# Altium project FlexV1.PrjPcb (part 2 of 3)

## Sheet PowerMM.SchDoc
size A4; Organization: TU Darmstadt; Address1: IES; Address2: Merckstraße 25; Address3: 64283 Darmstadt; Address4: Germany; SheetNumber: 3; SheetTotal: 4
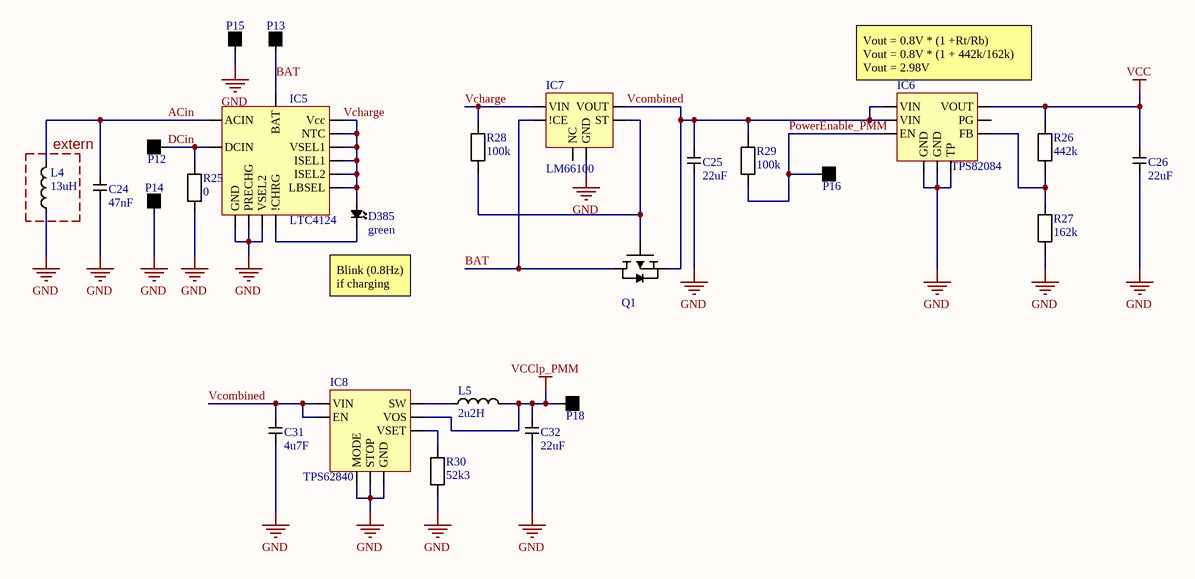
[diagram p2: PowerMM.SchDoc]

### Parts
C24  47nF  [RC0603]
C25  22uF  [C0805]
C26  22uF  [C0805]
C31  4u7F  [C0805]
C32  22uF  [C0805]
D385  green  [LTST-C190EKT]
IC5  LTC4124  [LTC4124]
IC6  TPS82084  [TPS82084]
IC7  LM66100  [LM66100]
IC8  TPS62840  [TPS62840DLC]
L4  13uH  [ChargeInductorPads]
L5  2u2H  [C0805]
P12  Solderpad  [SolderPad]  (value not drawn)  (no BOM)
P13  Solderpad  [SolderPad]  (value not drawn)  (no BOM)
P14  Solderpad  [SolderPad]  (value not drawn)  (no BOM)
P15  Solderpad  [SolderPad]  (value not drawn)  (no BOM)
P16  Solderpad  [SolderPad]  (value not drawn)  (no BOM)
P18  Solderpad  [SolderPad]  (value not drawn)  (no BOM)
Q1  NTR4101PT1G  [NTR4101P]  (value not drawn)
R25  0  [RC0402]
R26  442k  [RC0603]
R27  162k  [RC0603]
R28  100k  [RC0603]
R29  100k  [RC0603]
R30  52k3  [RC0603]

### Blocks framed on the sheet
extern: L4

### Nets
GND: C24.1 C25.1 C26.1 C31.1 C32.1 IC5.3(PRECHG) IC5.5(VSEL2) IC5.13(GND) IC6.5(GND) IC6.6(GND) IC6.9(TP) IC7.2(GND) IC8.1(GND) IC8.3(MODE) IC8.6(STOP) L4.1(X) P14.1 P15.1 R25.1 R27.1 R30.1
VCC: C26.2 IC6.8(VOUT) R26.2
VCClp_PMM: C32.2 IC8.8(VOS) L5.2(X) P18.1
ACin: C24.2 IC5.11(ACIN) L4.2(X)
BAT: IC5.10(BAT) IC7.3(!CE) P13.1 Q1.3
DCin: IC5.12(DCIN) P12.1 R25.2
PowerEnable_PMM: IC6.1(EN) P16.1 R29.1
Vcharge: D385.A IC5.1(Vcc) IC5.4(VSEL1) IC5.6(ISEL1) IC5.7(ISEL2) IC5.8(LBSEL) IC5.9(NTC) IC7.1(VIN) R28.2
Vcombined: C25.2 C31.2 IC6.3(VIN) IC6.4(VIN) IC7.6(VOUT) IC8.2(VIN) IC8.4(EN) Q1.2 R29.2
NetD385_K: D385.K IC5.2(!CHRG)
NetIC6_7: IC6.7(FB) R26.1 R27.2
NetIC7_5: IC7.5(ST) Q1.1 R28.1
NetIC8_5: IC8.5(VSET) R30.2
NetIC8_7: IC8.7(SW) L5.1(X)

Not connected (* = marked no-connect by the designer): IC6 2(PG); IC7 4(NC)

### Notes on the sheet
- (near IC6) Vout = 0.8V * (1 +Rt/Rb)
  Vout = 0.8V * (1 + 442k/162k)
  Vout = 2.98V
- DCIN:5.5-3.3V
- Backup resistor
  I
- Blink (0.8Hz) if charging
- Value from table page 13
- Title:
- File:
- Project:
- Variant:
- Date:
- Revision:
- Author:
- Sheet:
- of

### Library data of the parts
C24 = CL10B473KB8NNNC: CAP CER 0.047UF 50V X7R 0603; Manufacturer: Samsung; Material: Ceramic; Dielectric: Y5V; Tolerance: 10%; Supplier 1: Digi-Key; Manufacturer Part Number: CL10B473KB8NNNC; RoHS: Yes; Category: Ceramic Capacitors; Stock 1: 49161; Pricing 1: 1=0,10000, 10=0,04200, 100=0,01860, 500=0,01328, 1000=0,01044 (USD); Mount: Surface Mount; Case/Package: 0603; Contact Plating: Tin; Case Code (Imperial): 0603; Case Code (Metric): 1608; Min Operating Temperature: -55°C; Max Operating Temperature: 125°C; Packaging: Tape and Reel; Package Quantity: 4000; Voltage Rating (DC): 50V; Capacitance: 47nF; Voltage Rating: 50V; Voltage: 50V; Length: 1.6mm; Height: 0.8mm; Thickness: 0.035inch; Depth: 0.8mm; Width: 0.031inch; Radiation Hardening: No; Lead Free: Lead Free; ComponentLink1URL: https://datasheet.ciiva.com/25802/cl10b473kb8nnnc-25802915.pdf?src-supplier=Digi-Key; ComponentLink1Description: https://datasheet.ciiva.com/25802/cl10b473kb8nnnc-25802915.pdf?src-supplier=Digi-Key; ComponentLink2URL: https://datasheet.ciiva.com/15216/getdatasheetpartid-359560-15216232.pdf?src-supplier=Verical; ComponentLink2Description: https://datasheet.ciiva.com/15216/getdatasheetpartid-359560-15216232.pdf?src-supplier=Verical; ComponentLink3URL: https://datasheet.ciiva.com/29198/456947-da-01-en-vs-kondensator-0603-29198896.pdf?src-supplier=Conrad; ComponentLink3Description: https://datasheet.ciiva.com/29198/456947-da-01-en-vs-kondensator-0603-29198896.pdf?src-supplier=Conrad; ComponentLink4URL: https://datasheet.ciiva.com/26310/mlcc-catalogdownload2013-eng-26310327.pdf?src-supplier=Distrelec; ComponentLink4Description: https://datasheet.ciiva.com/26310/mlcc-catalogdownload2013-eng-26310327.pdf?src-supplier=Distrelec; ComponentLink5URL: https://datasheet.ciiva.com/20173/71-0317-20173339.pdf?src-supplier=Rapid+Electronics; ComponentLink5Description: https://datasheet.ciiva.com/20173/71-0317-20173339.pdf?src-supplier=Rapid+Electronics; Supplier Part Number 1: 1276-1063-1-ND
C25 C26 C32 = C2012X7S1A226M125AC: TDK - C2012X7S1A226M125AC - SMD Multilayer Ceramic Capacitor, 22 µF, 10 V, 0805 [2012 Metric], ± 20%, X7S, C Series TDK; Voltage Rating (DC): 10V; Supplier 1: Digi-Key; Manufacturer: TDK; Manufacturer Part Number: C2012X7S1A226M125AC; RoHS: Yes; Category: Ceramic Capacitors; Stock 1: 665121; Pricing 1: 1=0,97000, 10=0,74000, 100=0,52940, 500=0,40986, 1000=0,35294 (USD); Mount: Surface Mount; Case/Package: 0805; Weight: 0.000194oz; Case Code (Imperial): 0805; Dielectric Material: Ceramic; Case Code (Metric): 2012; Min Operating Temperature: -55°C; Max Operating Temperature: 125°C; Termination: SMD/SMT; Package Quantity: 2000; Packaging: Tape and Reel; Capacitance: 22uF; Tolerance: 20%; Voltage Rating: 10V; Dielectric: X7S; Length: 0.079inch; Height: 1.25mm; Width: 1.25mm; Thickness: 0.057inch; Lead Free: Lead Free; REACH SVHC: No SVHC; ComponentLink1URL: https://datasheet.ciiva.com/14893/tdkmlcccaprange-14893287.pdf?src-supplier=Digi-Key; ComponentLink1Description: https://datasheet.ciiva.com/14893/tdkmlcccaprange-14893287.pdf?src-supplier=Digi-Key; ComponentLink2URL: https://datasheet.ciiva.com/14893/tdkmlcccaprange-14893288.pdf?src-supplier=Digi-Key; ComponentLink2Description: https://datasheet.ciiva.com/14893/tdkmlcccaprange-14893288.pdf?src-supplier=Digi-Key; ComponentLink3URL: https://datasheet.ciiva.com/14893/tdkmlcccaprange-14893289.pdf?src-supplier=Digi-Key; ComponentLink3Description: https://datasheet.ciiva.com/14893/tdkmlcccaprange-14893289.pdf?src-supplier=Digi-Key; Supplier Part Number 1: 445-14560-1-ND
C31 = CL21A475KAQNNNE: SAMSUNG ELECTRO-MECHANICS - CL21A475KAQNNNE - SMD Multilayer Ceramic Capacitor, 4.7 µF, 25 V, 0805 [2012 Metric], ± 10%, X5R, CL Series; Voltage Rating (DC): 25V; Capacitance: 4.7uF; Supplier 1: Digi-Key; Manufacturer: Samsung; Manufacturer Part Number: CL21A475KAQNNNE; RoHS: Yes; Category: Ceramic Capacitors; Stock 1: 481244; Pricing 1: 1=0,14000, 10=0,10000, 100=0,04680, 500=0,03282, 1000=0,02716 (USD); Mount: Surface Mount; Case/Package: 0805; Case Code (Metric): 2012; Case Code (Imperial): 0805; Min Operating Temperature: -55°C; Max Operating Temperature: 85°C; Dielectric: X5R; Package Quantity: 1; Packaging: Tape and Reel; Tolerance: 10%; Voltage Rating: 25V; Length: 2mm; Height: 1.25mm; Thickness: 0.055inch; Depth: 1.25mm; Width: 0.049inch; Radiation Hardening: No; Lead Free: Lead Free; ComponentLink1URL: https://datasheet.ciiva.com/25798/cl21a475kaqnnne-25798882.pdf?src-supplier=Digi-Key; ComponentLink1Description: https://datasheet.ciiva.com/25798/cl21a475kaqnnne-25798882.pdf?src-supplier=Digi-Key; Supplier Part Number 1: 1276-1244-1-ND
D385 = LTST-C190GKT: LED,  LTST-C190GKT; Manufacturer: Vishay Lite-On; Lens Color: Colorless; Luminous Intensity: 6mcd; Forward Voltage: 2.1V; Viewing Angle: 130°; Lens Style: Clear,Diffused,Colorless,Rectangular; Forward Current: 30mA; Power Rating: 100mW; Dominant Wavelength: 569nm; Test Current: 10mA; Lens Transparency: Clear; Number of Elements: 1; Reverse Voltage: 5V; Wavelength: 565nm; Voltage: 2V; Supplier 1: Digi-Key; Manufacturer Part Number: LTST-C190GKT; RoHS: Yes; Category: LEDs; Stock 1: 179506; Pricing 1: 1=0,24000, 10=0,17900, 100=0,08460, 500=0,05640, 1000=0,04418 (USD); Mount: Surface Mount; Case/Package: 0603; Number of Pins: 2; Color: Green; Case Code (Metric): 1608; Case Code (Imperial): 0603; Min Operating Temperature: -55°C; Max Operating Temperature: 85°C; Package Quantity: 1; Packaging: Tape and Reel; Illumination Color: Green; Power Dissipation: 100mW; Number of LEDs: 1; Length: 1.6mm; Height: 0.8mm; Width: 0.8mm; Depth: 0.8mm; Radiation Hardening: No; Lead Free: Lead Free; ComponentLink1URL: https://datasheet.ciiva.com/11775/0900766b80dc02a6-11775616.pdf?src-supplier=RSComponents; ComponentLink1Description: https://datasheet.ciiva.com/11775/0900766b80dc02a6-11775616.pdf?src-supplier=RSComponents; ComponentLink2URL: https://datasheet.ciiva.com/16392/lite-on20ltst-c190gkt-16392818.pdf?src-supplier=Future+Electronics; ComponentLink2Description: https://datasheet.ciiva.com/16392/lite-on20ltst-c190gkt-16392818.pdf?src-supplier=Future+Electronics; ComponentLink3URL: https://datasheet.ciiva.com/12403/lite-on-ltst-c190gkt-187204-12403884.pdf?src-supplier=Mouser; ComponentLink3Description: https://datasheet.ciiva.com/12403/lite-on-ltst-c190gkt-187204-12403884.pdf?src-supplier=Mouser; ComponentLink4URL: https://datasheet.ciiva.com/2109/ltst-c190gkt-2109985.pdf?src-supplier=Digi-Key; ComponentLink4Description: https://datasheet.ciiva.com/2109/ltst-c190gkt-2109985.pdf?src-supplier=Digi-Key; ComponentLink5URL: https://datasheet.ciiva.com/2109/ltst-c190gkt-2109987.pdf?src-supplier=Digi-Key; ComponentLink5Description: https://datasheet.ciiva.com/2109/ltst-c190gkt-2109987.pdf?src-supplier=Digi-Key; ComponentLink6URL: https://datasheet.ciiva.com/2109/ltst-c190gkt-2109986.pdf?src-supplier=Digi-Key; ComponentLink6Description: https://datasheet.ciiva.com/2109/ltst-c190gkt-2109986.pdf?src-supplier=Digi-Key; Supplier Part Number 1: 160-1183-1-ND
IC5 = LTC4124EV#TRMPBF: Linear Battery Charger Li-Ion 100mA 4V/4.1V/4.2V/4.35V 12-Pin LQFN EP Reel; Manufacturer: Analog Devices; Supplier 1: Digi-Key; Manufacturer Part Number: LTC4124EV#TRMPBF; RoHS: No; Category: Battery Management; Stock 1: 697; Pricing 1: 1=6,61000, 25=3,66000, 100=3,65400 (USD); Supplier Part Number 1: LTC4124EV#TRMPBFCT-ND
IC6 = TPS82084SILR: TEXAS INSTRUMENTS - TPS82084SILR - Convert. DC/DC POL, Ajust. Buck, Micro SIP, Entrée 2,5V à 6V, Sortie 0,8V à 6V/2A, 2,4MHz, µSIP-8; Number of Outputs: 1; Min Input Voltage: 2.5V; Min Output Voltage: 800mV; Output Current: 2A; Switching Frequency: 2.4MHz; Synchronous Rectifier: Yes; Efficiency: 95%; Quiescent Current: 17uA; Output Type: Adjustable; Output Configuration: Positive; Supplier 1: Digi-Key; Manufacturer: Texas Instruments; Manufacturer Part Number: TPS82084SILR; RoHS: Yes; Category: Board Mount Modules; Stock 1: 15299; Pricing 1: 1=2,78000, 10=2,49900, 25=2,36240, 100=1,89000, 250=1,78500, 500=1,68000, 1000=1,43850 (USD); Mount: Surface Mount; Case/Package: Module; Number of Pins: 8; Min Operating Temperature: -40°C; Max Operating Temperature: 125°C; Packaging: Tape and Reel; Max Input Voltage: 6V; Max Output Voltage: 6V; Output Voltage: 6V; Max Output Current: 2A; Operating Supply Voltage: 6V; Lead Free: Lead Free; ComponentLink1URL: http://www.ti.com/lit/ds/symlink/tps82084.pdf?src-supplier=Digi-Key; ComponentLink1Description: http://www.ti.com/lit/ds/symlink/tps82084.pdf?src-supplier=Digi-Key; ComponentLink2URL: http://www.ti.com/general/docs/suppproductinfo.tsp?distId=10&amp;gotoUrl=http%3A%2F%2Fwww.ti.com%2Flit%2Fgpn%2Ftps82084&src-supplier=Digi-Key; ComponentLink2Description: http://www.ti.com/general/docs/suppproductinfo.tsp?distId=10&amp;gotoUrl=http%3A%2F%2Fwww.ti.com%2Flit%2Fgpn%2Ftps82084&src-supplier=Digi-Key; ComponentLink3URL: http://www.ti.com/general/docs/lit/getliterature.tsp?genericPartNumber=TPS82084&&fileType=pdf&src-supplier=Avnet; ComponentLink3Description: http://www.ti.com/general/docs/lit/getliterature.tsp?genericPartNumber=TPS82084&&fileType=pdf&src-supplier=Avnet; Supplier Part Number 1: 296-46279-1-ND
IC7 = LM66100DCKR: 1.5-V to 5.5-V, 1.5-A, 0.5-uA IQ ideal diode with Integrated FET 6-SC70 -40 to 105; Manufacturer: Texas Instruments; Supplier 1: Digi-Key; Manufacturer Part Number: LM66100DCKR; RoHS: No; Category: Integrated Circuits (ICs); Stock 1: 5662; Pricing 1: 1=0,41000, 10=0,32900, 25=0,30120, 100=0,20300, 250=0,16800, 500=0,15400, 1000=0,11550 (USD); Supplier Part Number 1: 296-53541-1-ND
IC8 = TPS62840DLCR: 60-nA IQ, 1.8-V to 6.5-VIN, high-efficiency 750-mA step-down converter 8-VSON-HR -40 to 125; Manufacturer: Texas Instruments; Supplier 1: Digi-Key; Manufacturer Part Number: TPS62840DLCR; RoHS: No; Category: Voltage Regulators - Switching; Stock 1: 6619; Pricing 1: 1=1,83000, 10=1,64300, 25=1,55000, 100=1,24000, 250=1,08500, 500=1,05400, 1000=0,83700 (USD); Supplier Part Number 1: 296-TPS62840DLCRCT-ND
L4 = 760308101208: WURTH ELEKTRONIK - 760308101208 - WIRELESS POWER CHARGING COIL, 13UH, 10%; Manufacturer: Wurth Electronics; Logic Function: Receiver; Current Rating: 800mA; Saturation Current: 2A; DC Resistance (DCR): 400mR; Self Resonant Frequency: 26MHz; Resistance: 0.5R; Q Factor: 17; Supplier 1: Digi-Key; Manufacturer Part Number: 760308101208; RoHS: Yes; Stock 1: 128; Pricing 1: 1=9,86000, 50=9,31800, 100=7,88500, 250=6,81004, 500=5,73402 (USD); Min Operating Temperature: -20°C; Max Operating Temperature: 105°C; Inductance: 13uH; Tolerance: 10%; Inductance Tolerance: 10%; Packaging: Bulk; Package Quantity: 1080; Diameter: 10mm; Length: 0.39inch; Height: 0.07inch; Width: 1.68mm; REACH SVHC: Unknown; ComponentLink1URL: http://www.farnell.com/datasheets/2061864.pdf?src-supplier=Farnell; ComponentLink1Description: http://www.farnell.com/datasheets/2061864.pdf?src-supplier=Farnell; ComponentLink2URL: http://www.mouser.com/ds/2/445/760308101208-516443.pdf?src-supplier=Mouser; ComponentLink2Description: http://www.mouser.com/ds/2/445/760308101208-516443.pdf?src-supplier=Mouser; ComponentLink3URL: http://www.farnell.com/datasheets/1880947.pdf?src-supplier=Element14; ComponentLink3Description: http://www.farnell.com/datasheets/1880947.pdf?src-supplier=Element14; Supplier Part Number 1: 732-6205-ND
L5 = MLZ2012N2R2LT000: Inductor Power Shielded Multi-Layer 2.2uH 20% 2MHz Ferrite 0.8A 0.156Ohm DCR 0805 T/R; Manufacturer: TDK; DC Resistance (DCR): 156mR; Self Resonant Frequency: 120MHz; Current Rating: 800mA; Saturation Current: 170mA; Supplier 1: Digi-Key; Manufacturer Part Number: MLZ2012N2R2LT000; RoHS: Yes; Category: Fixed Inductors; Stock 1: 10911; Pricing 1: 1=0,14000, 10=0,12900, 100=0,08630, 500=0,07188, 1000=0,06038 (USD); Mount: Surface Mount; Case/Package: 0805; Core Material: Ferrite; Case Code (Metric): 2012; Case Code (Imperial): 0805; Min Operating Temperature: -55°C; Max Operating Temperature: 125°C; Inductance: 2.2uH; Test Frequency: 2MHz; Package Quantity: 1; Packaging: Tape and Reel; Tolerance: 20%; Shielding: Shielded; Length: 0.079inch; Height - Seated (Max): 0.041inch; Width: 0.049inch; ComponentLink1URL: https://datasheet.ciiva.com/29698/inductor-commercial-decoupling-mlz-en-29698918.pdf?src-supplier=Digi-Key; ComponentLink1Description: https://datasheet.ciiva.com/29698/inductor-commercial-decoupling-mlz-en-29698918.pdf?src-supplier=Digi-Key; ComponentLink2URL: https://datasheet.ciiva.com/29698/inductor-commercial-decoupling-mlz-en-29698919.pdf?src-supplier=Digi-Key; ComponentLink2Description: https://datasheet.ciiva.com/29698/inductor-commercial-decoupling-mlz-en-29698919.pdf?src-supplier=Digi-Key; ComponentLink3URL: https://datasheet.ciiva.com/29698/inductor-commercial-decoupling-mlz-en-29698920.pdf?src-supplier=Digi-Key; ComponentLink3Description: https://datasheet.ciiva.com/29698/inductor-commercial-decoupling-mlz-en-29698920.pdf?src-supplier=Digi-Key; Supplier Part Number 1: 445-6758-1-ND
Q1 = NTR4101PT1G: ON SEMICONDUCTOR - NTR4101PT1G - MOSFET Transistor, P Channel, 3.2 A, -20 V, 0.07 ohm, -4.5 V, -720 mV; Nominal Vgs: -720mV; Input Capacitance: 675pF; Number of Elements: 1; Max Power Dissipation: 730mW; Rise Time: 12.6ns; Rds On Max: 85mR; Drain to Source Voltage (Vdss): 20V; Continuous Drain Current (ID): -3.2A; Drain to Source Resistance: 112mR; Turn-Off Delay Time: 30.2ns; Turn-On Delay Time: 7.5ns; Element Configuration: Single; Drain to Source Breakdown Voltage: -20V; Gate to Source Voltage (Vgs): 8V; On-State Resistance: 70MR; Supplier 1: Digi-Key; Manufacturer: ON Semiconductor; Manufacturer Part Number: NTR4101PT1G; RoHS: Yes; Category: MOSFETs; Stock 1: 88776; Pricing 1: 1=0,38000, 10=0,28000, 25=0,24520, 100=0,13300, 250=0,13232, 500=0,10850, 1000=0,08050 (USD); Case/Package: SOT-23-3; Number of Pins: 3; Contact Plating: Tin,Matte; Min Operating Temperature: -55°C; Max Operating Temperature: 150°C; Package Quantity: 1; Packaging: Tape and Reel; Fall Time: 12.6ns; Power Dissipation: 730mW; Threshold Voltage: -720mV; Voltage Rating (DC): -20V; Current Rating: -3.2A; Length: 2.9mm; Height: 0.94mm; Width: 1.3mm; Radiation Hardening: No; REACH SVHC: No SVHC; Lead Free: Lead Free; ComponentLink1URL: https://datasheet.ciiva.com/22641/1708314-22641689.pdf?src-supplier=Element14; ComponentLink1Description: https://datasheet.ciiva.com/22641/1708314-22641689.pdf?src-supplier=Element14; ComponentLink2URL: https://datasheet.ciiva.com/17009/0900766b80dad822-17009068.pdf?src-supplier=Allied+Electronics; ComponentLink2Description: https://datasheet.ciiva.com/17009/0900766b80dad822-17009068.pdf?src-supplier=Allied+Electronics; ComponentLink3URL: https://datasheet.ciiva.com/34303/2017033-34303870.pdf?src-supplier=Jameco; ComponentLink3Description: https://datasheet.ciiva.com/34303/2017033-34303870.pdf?src-supplier=Jameco; ComponentLink4URL: https://datasheet.ciiva.com/936/ntr4101p-d-936839.pdf?src-supplier=Digi-Key; ComponentLink4Description: https://datasheet.ciiva.com/936/ntr4101p-d-936839.pdf?src-supplier=Digi-Key; ComponentLink5URL: https://datasheet.ciiva.com/936/ntr4101p-d-936840.pdf?src-supplier=Digi-Key; ComponentLink5Description: https://datasheet.ciiva.com/936/ntr4101p-d-936840.pdf?src-supplier=Digi-Key; ComponentLink6URL: https://datasheet.ciiva.com/936/ntr4101p-d-936841.pdf?src-supplier=Digi-Key; ComponentLink6Description: https://datasheet.ciiva.com/936/ntr4101p-d-936841.pdf?src-supplier=Digi-Key; ComponentLink7URL: https://datasheet.ciiva.com/11168/ntr4101p-d-11168185.pdf?src-supplier=Avnet; ComponentLink7Description: https://datasheet.ciiva.com/11168/ntr4101p-d-11168185.pdf?src-supplier=Avnet; ComponentLink8URL: https://datasheet.ciiva.com/16208/ntr4101p-d-16208809.pdf?src-supplier=Future+Electronics; ComponentLink8Description: https://datasheet.ciiva.com/16208/ntr4101p-d-16208809.pdf?src-supplier=Future+Electronics; ComponentLink9URL: https://datasheet.ciiva.com/8114/ntr4101p-d-8114939.pdf?src-supplier=Avnet; ComponentLink9Description: https://datasheet.ciiva.com/8114/ntr4101p-d-8114939.pdf?src-supplier=Avnet; Supplier Part Number 1: NTR4101PT1GOSCT-ND
R25 = RC0402JR-070RL: RES SMD 0 OHM JUMPER 1/16W 0402; Manufacturer: Yageo; Resistance: 0mR; Power Rating: 62.5mW; Tolerance: 5%; Voltage Rating: 50V; Max Power Dissipation: 63mW; Temperature Coefficient: 200ppm/°C; Supplier 1: Digi-Key; Manufacturer Part Number: RC0402JR-070RL; Stock 1: 80146051; Pricing 1: 1 = 0,10000, 10 = 0,01500, 25 = 0,01080, 50 = 0,00800, 100 = 0,00600, 250 = 0,00456, 500 = 0,00364, 1000 = 0,00268, 5000 = 0,00192 (USD); RoHS: Yes; Case/Package: 0402; Contact Plating: Tin; Case Code (Metric): 1005; Case Code (Imperial): 0402; Min Operating Temperature: -55°C; Max Operating Temperature: 155°C; Packaging: Tape and Reel; Composition: Thick Film; Package Quantity: 1; Number of Terminations: 2; Termination: SMD/SMT; Military Standard: Not; Features: Moisture Resistant; Length: 1mm; Height: 0.016inch; Width: 0.02inch; Depth: 0.5mm; Radiation Hardening: No; REACH SVHC: Unknown; Lead Free: Lead Free; ComponentLink1URL: https://datasheet.ciiva.com/2452/pyu-rc0402-51-rohs-l-6-2452608.pdf?src-supplier=Digi-Key; ComponentLink1Description: https://datasheet.ciiva.com/2452/pyu-rc0402-51-rohs-l-6-2452608.pdf?src-supplier=Digi-Key; ComponentLink2URL: https://datasheet.ciiva.com/11808/0900766b80c66297-11808195.pdf?src-supplier=RSComponents; ComponentLink2Description: https://datasheet.ciiva.com/11808/0900766b80c66297-11808195.pdf?src-supplier=RSComponents; ComponentLink3URL: https://datasheet.ciiva.com/2452/pyu-r-int-thick-7-2452609.pdf?src-supplier=Digi-Key; ComponentLink3Description: https://datasheet.ciiva.com/2452/pyu-r-int-thick-7-2452609.pdf?src-supplier=Digi-Key; ComponentLink4URL: https://datasheet.ciiva.com/2452/pyu-r-int-thick-7-2452610.pdf?src-supplier=Digi-Key; ComponentLink4Description: https://datasheet.ciiva.com/2452/pyu-r-int-thick-7-2452610.pdf?src-supplier=Digi-Key; ComponentLink5URL: https://datasheet.ciiva.com/8896/pyu-rc0402-51-rohs-l-6-8896201.pdf?src-supplier=Avnet; ComponentLink5Description: https://datasheet.ciiva.com/8896/pyu-rc0402-51-rohs-l-6-8896201.pdf?src-supplier=Avnet; ComponentLink6URL: https://datasheet.ciiva.com/28386/pyu-rc0402-51-rohs-l-6-28386633.pdf?src-supplier=Avnet+Europe; ComponentLink6Description: https://datasheet.ciiva.com/28386/pyu-rc0402-51-rohs-l-6-28386633.pdf?src-supplier=Avnet+Europe; ComponentLink7URL: https://datasheet.ciiva.com/22747/1018594-22747515.pdf?src-supplier=Element14; ComponentLink7Description: https://datasheet.ciiva.com/22747/1018594-22747515.pdf?src-supplier=Element14; ComponentLink8URL: https://datasheet.ciiva.com/15189/getdatasheetpartid-326379-15189533.pdf?src-supplier=Verical; ComponentLink8Description: https://datasheet.ciiva.com/15189/getdatasheetpartid-326379-15189533.pdf?src-supplier=Verical; ComponentLink9URL: https://datasheet.ciiva.com/7983/1018594-7983535.pdf?src-supplier=Element14; ComponentLink9Description: https://datasheet.ciiva.com/7983/1018594-7983535.pdf?src-supplier=Element14; Supplier Part Number 1: 311-0.0JRCT-ND
R26 = RT0603DRE07442KL: RES SMD 442K OHM 0.5% 1/10W 0603; Manufacturer: Yageo; Resistance: 442kR; Max Power Dissipation: 100mW; Temperature Coefficient: 50ppm/°C; Supplier 1: Digi-Key; Manufacturer Part Number: RT0603DRE07442KL; RoHS: Yes; Category: Chip SMD Resistors; Stock 1: 1510; Pricing 1: 1=0,13000, 10=0,12000, 100=0,04620, 1000=0,02033, 2500=0,01756 (USD); Case/Package: 0603; Case Code (Metric): 1608; Case Code (Imperial): 0603; Min Operating Temperature: -55°C; Max Operating Temperature: 155°C; Packaging: Tape and Reel; Composition: Thin Film; Number of Terminations: 2; Tolerance: 0.5%; Features: Moisture Resistant; Length: 0.063inch; Height: 0.022inch; Width: 0.031inch; ComponentLink1URL: http://www.yageo.com/documents/recent/PYu-RT_1-to-0.01_RoHS_L_9.pdf?src-supplier=Digi-Key; ComponentLink1Description: http://www.yageo.com/documents/recent/PYu-RT_1-to-0.01_RoHS_L_9.pdf?src-supplier=Digi-Key; Supplier Part Number 1: 311-2099-1-ND
R27 = RT0603BRD07162KL: RES SMD 162K OHM 0.1% 1/10W 0603; Manufacturer: Yageo; Resistance: 162kR; Power Rating: 100mW; Voltage Rating: 75V; Temperature Coefficient: 25ppm/°C; Voltage Rating (DC): 50V; Supplier 1: Digi-Key; Manufacturer Part Number: RT0603BRD07162KL; RoHS: Yes; Category: Chip SMD Resistors; Stock 1: 5014; Pricing 1: 1=0,36000, 10=0,30500, 100=0,11910, 1000=0,04984, 2500=0,04569 (USD); Case/Package: 0603; Case Code (Metric): 1608; Case Code (Imperial): 0603; Min Operating Temperature: -55°C; Max Operating Temperature: 155°C; Package Quantity: 5000; Packaging: Tape and Reel; Tolerance: 0.1%; Composition: Thin Film; Number of Terminations: 2; Termination: SMD/SMT; Max Power Dissipation: 100mW; Features: Moisture Resistant; Length: 0.063inch; Height: 0.022inch; Width: 0.031inch; Lead Free: Lead Free; ComponentLink1URL: https://datasheet.ciiva.com/46635/pyu-rt-1-to-0-05-rohs-l-5-46635013.pdf?src-supplier=Digi-Key; ComponentLink1Description: https://datasheet.ciiva.com/46635/pyu-rt-1-to-0-05-rohs-l-5-46635013.pdf?src-supplier=Digi-Key; ComponentLink2URL: https://datasheet.ciiva.com/2585/pyu-rt-1-to-0-05-rohs-l-4-2585692.pdf?src-supplier=Digi-Key; ComponentLink2Description: https://datasheet.ciiva.com/2585/pyu-rt-1-to-0-05-rohs-l-4-2585692.pdf?src-supplier=Digi-Key; ComponentLink3URL: https://datasheet.ciiva.com/12703/pyu-rt-1-to-0-05-rohs-l-4-12703182.pdf?src-supplier=Mouser; ComponentLink3Description: https://datasheet.ciiva.com/12703/pyu-rt-1-to-0-05-rohs-l-4-12703182.pdf?src-supplier=Mouser; Supplier Part Number 1: YAG1541CT-ND
R28 R29 = RC0603JR-07100KL: RES SMD 100K OHM 5% 1/10W 0603; Manufacturer: Yageo; Resistance: 100kR; Voltage Rating (DC): 50V; Temperature Coefficient: 100ppm/°C; Power Rating: 100mW; Supplier 1: Digi-Key; Manufacturer Part Number: RC0603JR-07100KL; Stock 1: 12318541; Pricing 1: 1 = 0,10000, 10 = 0,02000, 100 = 0,00810, 1000 = 0,00362, 2500 = 0,00314 (USD); RoHS: Yes; Case/Package: 0603; Number of Pins: 2; Contact Plating: Tin; Case Code (Imperial): 0603; Case Code (Metric): 1608; Min Operating Temperature: -55°C; Max Operating Temperature: 155°C; Packaging: Tape and Reel; Tolerance: 5%; Composition: Thick Film; Voltage Rating: 50V; Termination: SMD/SMT; Width: 0.8mm; Radiation Hardening: No; REACH SVHC: No SVHC; Lead Free: Lead Free; ComponentLink1URL: https://datasheet.ciiva.com/7983/443971-7983686.pdf?src-supplier=Element14; ComponentLink1Description: https://datasheet.ciiva.com/7983/443971-7983686.pdf?src-supplier=Element14; ComponentLink2URL: https://datasheet.ciiva.com/7746/443971-7746423.pdf?src-supplier=Element14; ComponentLink2Description: https://datasheet.ciiva.com/7746/443971-7746423.pdf?src-supplier=Element14; ComponentLink3URL: https://datasheet.ciiva.com/7746/443971-7746424.pdf?src-supplier=Element14; ComponentLink3Description: https://datasheet.ciiva.com/7746/443971-7746424.pdf?src-supplier=Element14; ComponentLink4URL: https://datasheet.ciiva.com/8887/pyu-rc0603-51-rohs-l-4-8887903.pdf?src-supplier=Avnet; ComponentLink4Description: https://datasheet.ciiva.com/8887/pyu-rc0603-51-rohs-l-4-8887903.pdf?src-supplier=Avnet; Supplier Part Number 1: 311-100KGRCT-ND
R30 = RC0603FR-0752K3L: Res Thick Film 0603 52.3K Ohm 1% 0.1W(1/10W) ±100ppm/C Epoxy SMD T/R; Manufacturer: Yageo; Resistance: 52.3kR; Power Rating: 100mW; Voltage Rating: 75V; Temperature Coefficient: 100ppm/°C; Voltage Rating (DC): 50V; Supplier 1: Digi-Key; Manufacturer Part Number: RC0603FR-0752K3L; RoHS: Yes; Category: Chip SMD Resistors; Stock 1: 426097; Pricing 1: 1=0,10000, 10=0,02300, 100=0,00940, 1000=0,00421, 2500=0,00366 (USD); Case/Package: 0603; Weight: 7.1E-05oz; Case Code (Imperial): 0603; Case Code (Metric): 1608; Min Operating Temperature: -55°C; Max Operating Temperature: 155°C; Tolerance: 1%; Packaging: Tape and Reel; Termination: SMD/SMT; Composition: Thick Film; Military Standard: Not; Length: 1.6mm; Height: 0.45mm; Depth: 0.8mm; Width: 0.8mm; Lead Free: Lead Free; ComponentLink1URL: http://www.mouser.com/ds/2/447/RC0603-272842.pdf?src-supplier=Mouser; ComponentLink1Description: http://www.mouser.com/ds/2/447/RC0603-272842.pdf?src-supplier=Mouser; ComponentLink2URL: http://components.arrow.com/part/dataview/0323_03543171?src-supplier=Arrow+Europe; ComponentLink2Description: http://components.arrow.com/part/dataview/0323_03543171?src-supplier=Arrow+Europe; ComponentLink3URL: https://www.verical.com/server-webapp/html/getDatasheet?partID=326514&src-supplier=Verical; ComponentLink3Description: https://www.verical.com/server-webapp/html/getDatasheet?partID=326514&src-supplier=Verical; ComponentLink4URL: http://www.yageo.com/documents/recent/PYu-RC_Group_51_RoHS_L_10.pdf?src-supplier=Digi-Key; ComponentLink4Description: http://www.yageo.com/documents/recent/PYu-RC_Group_51_RoHS_L_10.pdf?src-supplier=Digi-Key; ComponentLink5URL: http://www.yageo.com/documents/recent/PYu-RC0603_51_RoHS_L_7.pdf?src-supplier=Future+Electronics; ComponentLink5Description: http://www.yageo.com/documents/recent/PYu-RC0603_51_RoHS_L_7.pdf?src-supplier=Future+Electronics; Supplier Part Number 1: 311-52.3KHRCT-ND